# Altium schematic sheet US_EPS_LM.SchDoc
size A2
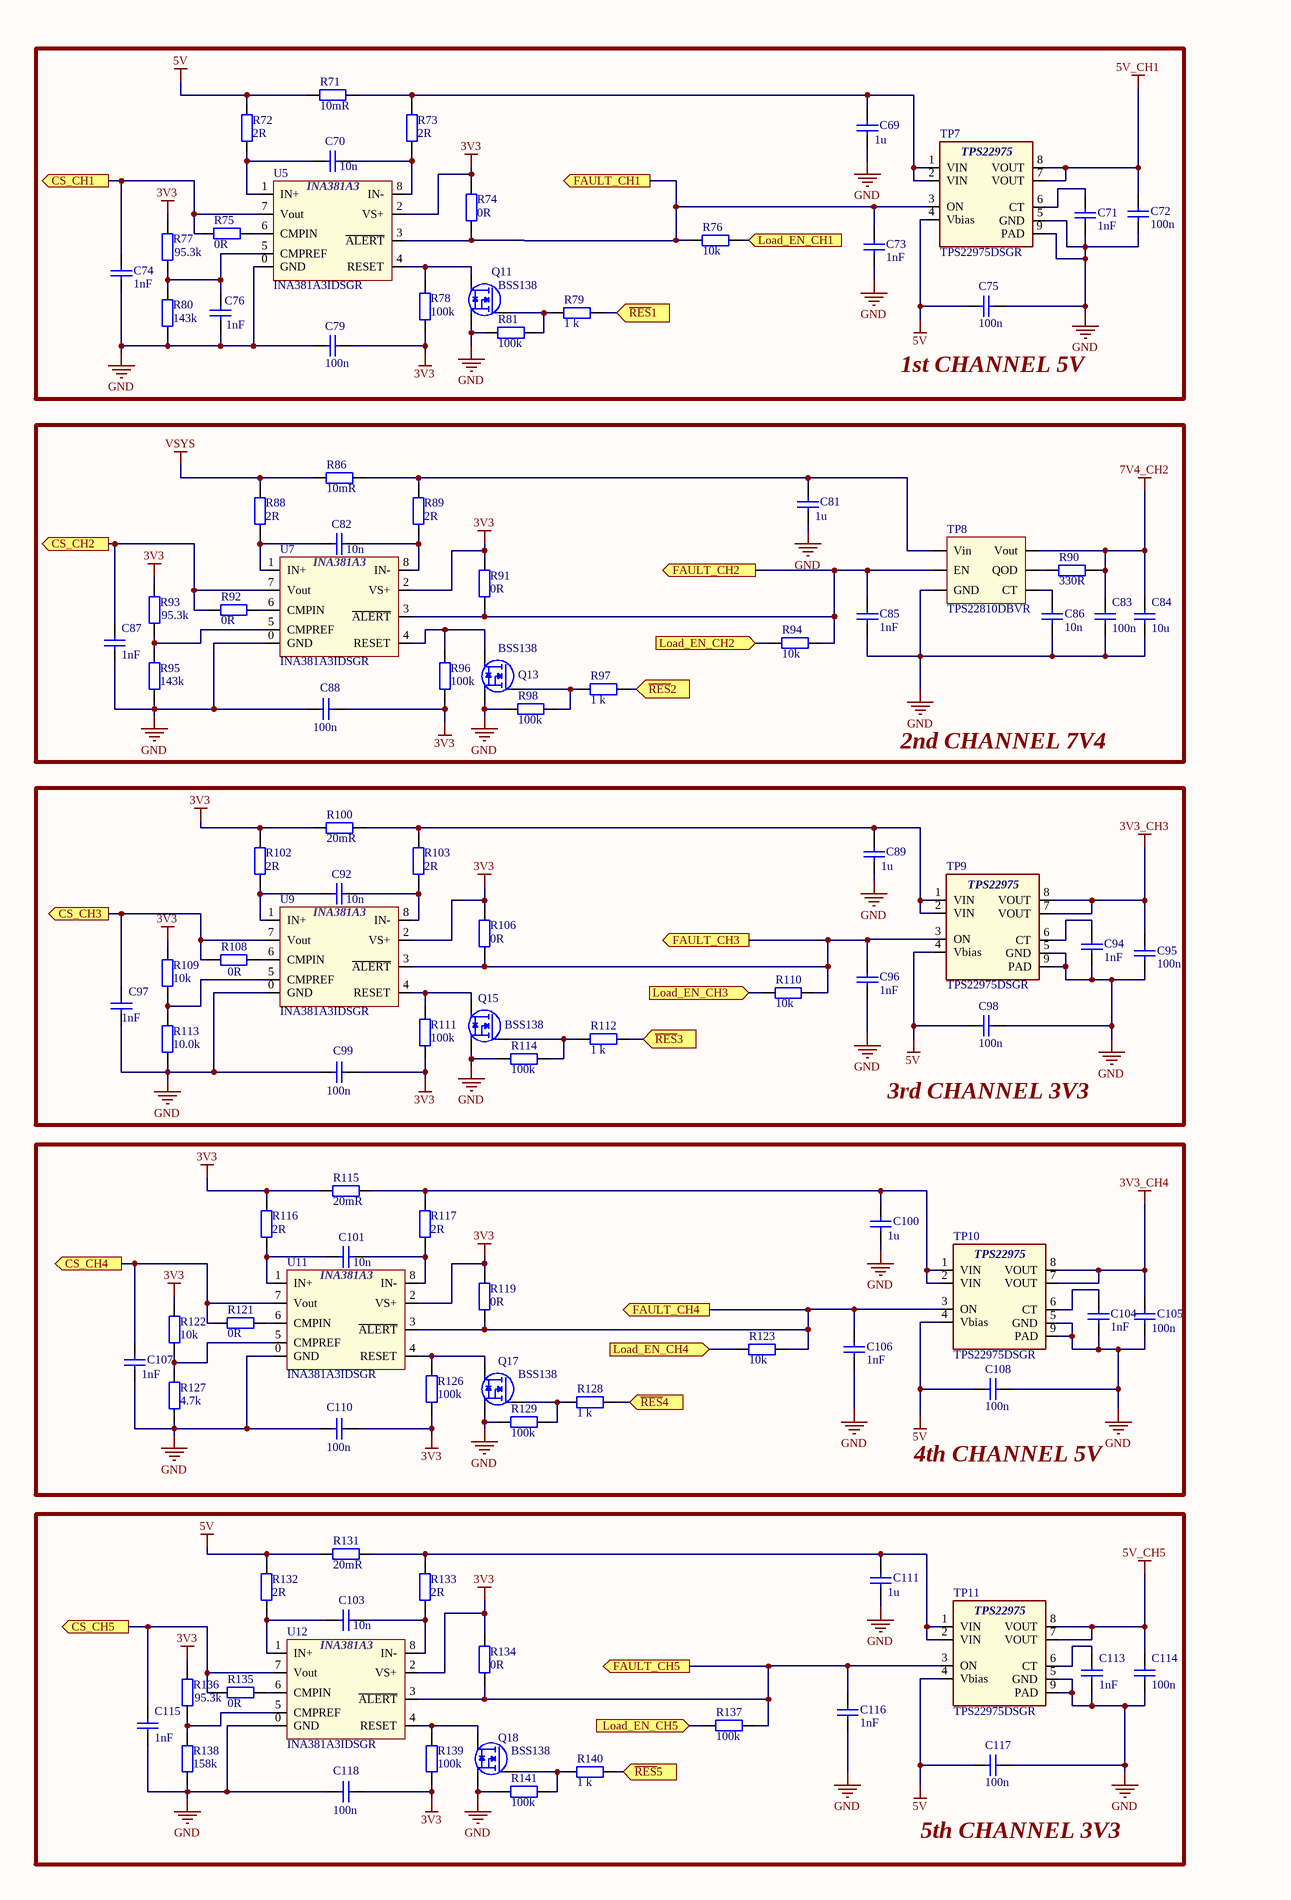
[diagram p0: US_EPS_LM.SchDoc, left]
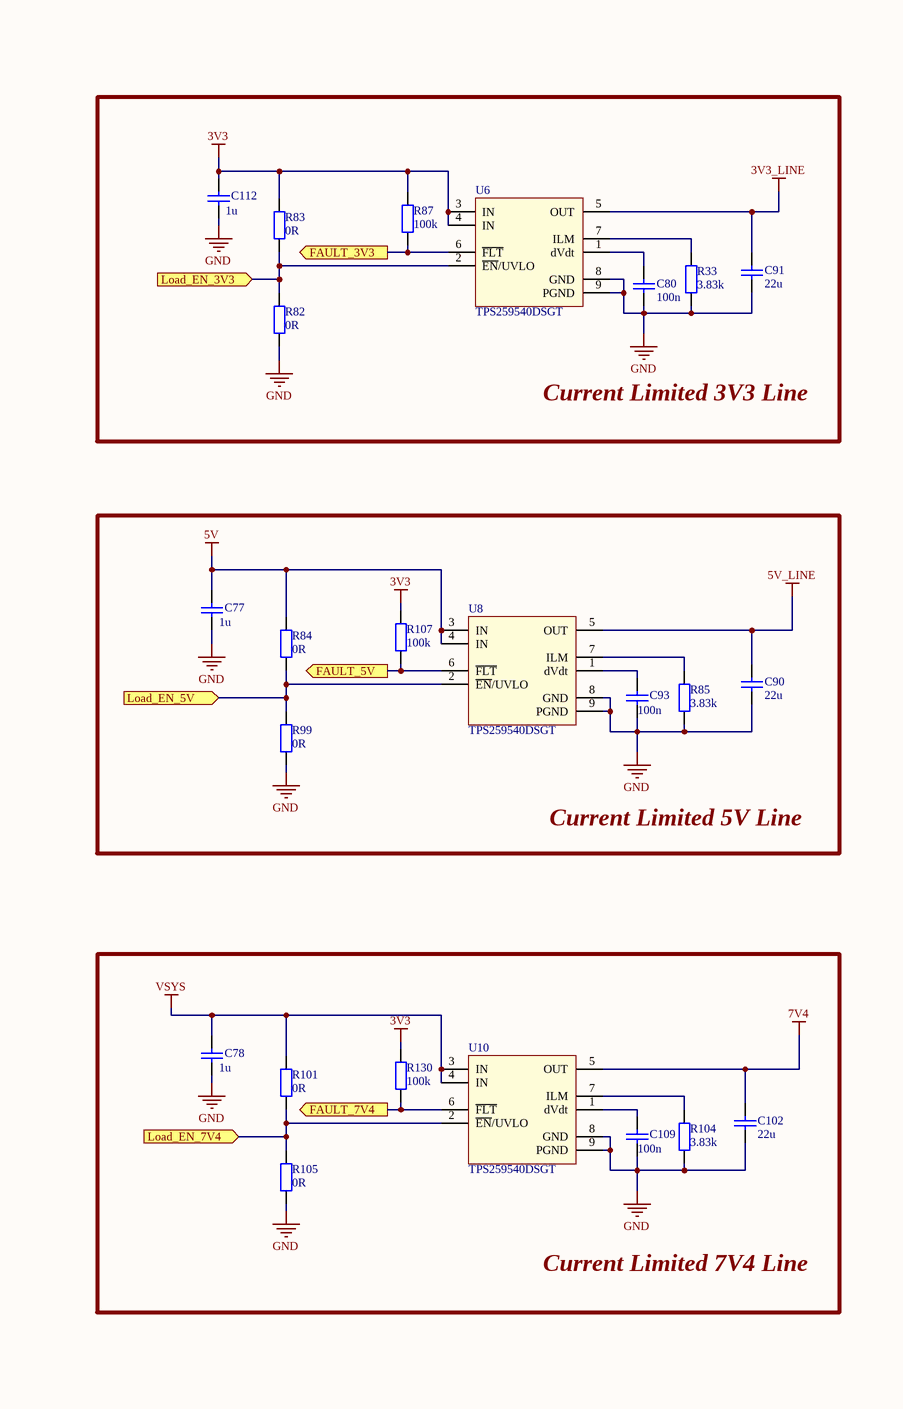
[diagram p1: US_EPS_LM.SchDoc, right]

## Parts
C69  1u  [C0603_IPC_HD]
C70  10n  [C0603_IPC_HD]
C71  1nF  [C0603_IPC_HD]
C72  100n  [C0603_IPC_HD]
C73  1nF  [C0603_IPC_HD]
C74  1nF  [C0603_IPC_HD]
C75  100n  [C0603_IPC_HD]
C76  1nF  [C0603_IPC_HD]
C77  1u  [C0603_IPC_HD]
C78  1u  [C0603_IPC_HD]
C79  100n  [C0603_IPC_HD]
C80  100n  [C0603_IPC_HD]
C81  1u  [C0603_IPC_HD]
C82  10n  [C0603_IPC_HD]
C83  100n  [C0603_IPC_HD]
C84  10u  [C0805_IPC_HD]
C85  1nF  [C0603_IPC_HD]
C86  10n  [C0603_IPC_HD]
C87  1nF  [C0603_IPC_HD]
C88  100n  [C0603_IPC_HD]
C89  1u  [C0603_IPC_HD]
C90  22u  [C0805_IPC_HD]
C91  22u  [C0805_IPC_HD]
C92  10n  [C0603_IPC_HD]
C93  100n  [C0603_IPC_HD]
C94  1nF  [C0603_IPC_HD]
C95  100n  [C0603_IPC_HD]
C96  1nF  [C0603_IPC_HD]
C97  1nF  [C0603_IPC_HD]
C98  100n  [C0603_IPC_HD]
C99  100n  [C0603_IPC_HD]
C100  1u  [C0603_IPC_HD]
C101  10n  [C0603_IPC_HD]
C102  22u  [C0805_IPC_HD]
C103  10n  [C0603_IPC_HD]
C104  1nF  [C0603_IPC_HD]
C105  100n  [C0603_IPC_HD]
C106  1nF  [C0603_IPC_HD]
C107  1nF  [C0603_IPC_HD]
C108  100n  [C0603_IPC_HD]
C109  100n  [C0603_IPC_HD]
C110  100n  [C0603_IPC_HD]
C111  1u  [C0603_IPC_HD]
C112  1u  [C0603_IPC_HD]
C113  1nF  [C0603_IPC_HD]
C114  100n  [C0603_IPC_HD]
C115  1nF  [C0603_IPC_HD]
C116  1nF  [C0603_IPC_HD]
C117  100n  [C0603_IPC_HD]
C118  100n  [C0603_IPC_HD]
Q11  BSS138  [SOT23]
Q13  BSS138  [SOT23]
Q15  BSS138  [SOT23]
Q17  BSS138  [SOT23]
Q18  BSS138  [SOT23]
R33  3.83k  [C0603_IPC_HD]
R71  10mR  [WSLP1206R001]
R72  2R  [C0603_IPC_HD]
R73  2R  [C0603_IPC_HD]
R74  0R  [R0603_IPC_MD]
R75  0R  [R0603_IPC_MD]
R76  10k  [C0603_IPC_HD]
R77  95.3k  [C0603_IPC_HD]
R78  100k  [R0603_IPC_MD]
R79  1 k  [R0603_IPC_HD]
R80  143k  [C0603_IPC_HD]
R81  100k  [R0603_IPC_MD]
R82  0R  [R0603_IPC_MD]  (no BOM)
R83  0R  [R0603_IPC_MD]  (no BOM)
R84  0R  [R0603_IPC_MD]  (no BOM)
R85  3.83k  [C0603_IPC_HD]
R86  10mR  [WSLP1206R001]
R87  100k  [R0603_IPC_MD]
R88  2R  [C0603_IPC_HD]
R89  2R  [C0603_IPC_HD]
R90  330R  [R0603_IPC_MD]
R91  0R  [R0603_IPC_MD]
R92  0R  [R0603_IPC_MD]
R93  95.3k  [C0603_IPC_HD]
R94  10k  [C0603_IPC_HD]
R95  143k  [C0603_IPC_HD]
R96  100k  [R0603_IPC_MD]
R97  1 k  [R0603_IPC_HD]
R98  100k  [R0603_IPC_MD]
R99  0R  [R0603_IPC_MD]  (no BOM)
R100  20mR  [WSLP1206R002]
R101  0R  [R0603_IPC_MD]  (no BOM)
R102  2R  [C0603_IPC_HD]
R103  2R  [C0603_IPC_HD]
R104  3.83k  [C0603_IPC_HD]
R105  0R  [R0603_IPC_MD]  (no BOM)
R106  0R  [R0603_IPC_MD]
R107  100k  [R0603_IPC_MD]
R108  0R  [R0603_IPC_MD]
R109  10k  [C0603_IPC_HD]
R110  10k  [C0603_IPC_HD]
R111  100k  [R0603_IPC_MD]
R112  1 k  [R0603_IPC_HD]
R113  10.0k  [R0603_IPC_MD]
R114  100k  [R0603_IPC_MD]
R115  20mR  [WSLP1206R002]
R116  2R  [C0603_IPC_HD]
R117  2R  [C0603_IPC_HD]
R119  0R  [R0603_IPC_MD]
R121  0R  [R0603_IPC_MD]
R122  10k  [C0603_IPC_HD]
R123  10k  [C0603_IPC_HD]
R126  100k  [R0603_IPC_MD]
R127  4.7k  [C0603_IPC_HD]
R128  1 k  [R0603_IPC_HD]
R129  100k  [R0603_IPC_MD]
R130  100k  [R0603_IPC_MD]
R131  20mR  [WSLP1206R002]
R132  2R  [C0603_IPC_HD]
R133  2R  [C0603_IPC_HD]
R134  0R  [R0603_IPC_MD]
R135  0R  [R0603_IPC_MD]
R136  95.3k  [C0603_IPC_HD]
R137  100k  [R0603_IPC_MD]
R138  158k  [R0603_IPC_HD]
R139  100k  [R0603_IPC_MD]
R140  1 k  [R0603_IPC_HD]
R141  100k  [R0603_IPC_MD]
TP7  TPS22975DSGR  [SON127P600-TPS22975]
TP8  TPS22810DBVR  [TPS22810DBVR_SOT95P280X145-6N]
TP9  TPS22975DSGR  [SON127P600-TPS22975]
TP10  TPS22975DSGR  [SON127P600-TPS22975]
TP11  TPS22975DSGR  [SON127P600-TPS22975]
U5  INA381A3IDSGR  [SON127P600-8N(INA381)]
U6  TPS259540DSGT  [SON127P600-8N_TPS259540DSGT]
U7  INA381A3IDSGR  [SON127P600-8N(INA381)]
U8  TPS259540DSGT  [SON127P600-8N_TPS259540DSGT]
U9  INA381A3IDSGR  [SON127P600-8N(INA381)]
U10  TPS259540DSGT  [SON127P600-8N_TPS259540DSGT]
U11  INA381A3IDSGR  [SON127P600-8N(INA381)]
U12  INA381A3IDSGR  [SON127P600-8N(INA381)]

## Blocks framed on the sheet
1st CHANNEL 5V: C69-C76 C79 Q11 R71-R81 TP7 U5
Current Limited 3V3 Line: C80 C91 C112 R33 R82 R83 R87 U6
2nd CHANNEL 7V4: C81-C88 Q13 R86 R88-R98 TP8 U7
Current Limited 5V Line: C77 C90 C93 R84 R85 R99 R107 U8
3rd CHANNEL 3V3: C89 C92 C94-C99 Q15 R100 R102 R103 R106 R108-R114 TP9 U9
Current Limited 7V4 Line: C78 C102 C109 R101 R104 R105 R130 U10
4th CHANNEL 5V: C100 C101 C104-C108 C110 Q17 R115-R117 R119 R121-R123 R126-R129 TP10 U11
5th CHANNEL 3V3: C103 C111 C113-C118 Q18 R131-R141 TP11 U12

## Ports
CS_CH1 (out), CS_CH2 (out), CS_CH3 (out), CS_CH4 (out), CS_CH5 (out), FAULT_3V3 (out), FAULT_5V (out), FAULT_7V4 (out), FAULT_CH1 (out), FAULT_CH2 (out), FAULT_CH3 (out), FAULT_CH4 (out), FAULT_CH5 (out), Load_EN_3V3 (in), Load_EN_5V (in), Load_EN_7V4 (in), Load_EN_CH1 (in), Load_EN_CH2 (in), Load_EN_CH3 (in), Load_EN_CH4 (in), Load_EN_CH5 (in), ~{RES}1 (in), ~{RES}2 (in), ~{RES}3 (in), ~{RES}4 (in), ~{RES}5 (in)

## Nets
3V3: C79.1 C88.2 C99.2 C110.2 C112.2 C118.2 R74.1 R77.2 R78.1 R83.2 R87.2 R91.1 R93.2 R96.2 R100.1 R102.2 R106.1 R107.2 R109.1 R111.2 R115.1 R116.2 R119.1 R122.1 R126.2 R130.2 R134.1 R136.2 R139.2 U5.2(VS+) U6.3(IN) U6.4(IN) U7.2(VS+) U9.2(VS+) U11.2(VS+) U12.2(VS+)
3V3_CH3: C95.2 TP9.7(VOUT) TP9.8(VOUT)
3V3_CH4: C105.2 TP10.7(VOUT) TP10.8(VOUT)
3V3_LINE: C91.2 U6.5(OUT)
5V: C75.2 C77.2 C98.2 C108.2 C117.2 R71.1 R72.2 R84.2 R131.1 R132.2 TP7.4(Vbias) TP9.4(Vbias) TP10.4(Vbias) TP11.4(Vbias) U8.3(IN) U8.4(IN)
5V_CH1: C72.2 TP7.7(VOUT) TP7.8(VOUT)
5V_CH5: C114.2 TP11.7(VOUT) TP11.8(VOUT)
5V_LINE: C90.2 U8.5(OUT)
7V4: C102.2 U10.5(OUT)
7V4_CH2: C83.2 C84.2 R90.1 TP8.6(Vout)
GND: C69.1 C71.1 C72.1 C73.1 C74.1 C75.1 C76.1 C77.1 C78.1 C79.2 C80.2 C81.1 C83.1 C84.1 C85.1 C86.1 C87.1 C88.1 C89.1 C90.1 C91.1 C93.2 C94.1 C95.1 C96.1 C97.1 C98.1 C99.1 C100.1 C102.1 C104.1 C105.1 C106.1 C107.1 C108.1 C109.2 C110.1 C111.1 C112.1 C113.1 C114.1 C115.1 C116.1 C117.1 C118.1 Q11.2(S) Q13.2(S) Q15.2(S) Q17.2(S) Q18.2(S) R33.1 R80.1 R81.2 R82.1 R85.1 R95.1 R98.1 R99.1 R104.1 R105.1 R113.1 R114.1 R127.1 R129.1 R138.1 R141.1 TP7.5(GND) TP7.9(PAD) TP8.2(GND) TP9.5(GND) TP9.9(PAD) TP10.5(GND) TP10.9(PAD) TP11.5(GND) TP11.9(PAD) U5.0(GND) U6.8(GND) U6.9(PGND) U7.0(GND) U8.8(GND) U8.9(PGND) U9.0(GND) U10.8(GND) U10.9(PGND) U11.0(GND) U12.0(GND)
VSYS: C78.2 R86.1 R88.2 R101.2 U10.3(IN) U10.4(IN)
~{RES}1: R79.2 ; port ~{RES}1
~{RES}2: R97.2 ; port ~{RES}2
~{RES}3: R112.2 ; port ~{RES}3
~{RES}4: R128.2 ; port ~{RES}4
~{RES}5: R140.2 ; port ~{RES}5
CS_CH1: C74.2 R75.1 U5.7(Vout) ; port CS_CH1
CS_CH2: C87.2 R92.1 U7.7(Vout) ; port CS_CH2
CS_CH3: C97.2 R108.2 U9.7(Vout) ; port CS_CH3
CS_CH4: C107.2 R121.2 U11.7(Vout) ; port CS_CH4
CS_CH5: C115.2 R135.2 U12.7(Vout) ; port CS_CH5
FAULT_3V3: R87.1 U6.6(~{FLT}) ; port FAULT_3V3
FAULT_5V: R107.1 U8.6(~{FLT}) ; port FAULT_5V
FAULT_7V4: R130.1 U10.6(~{FLT}) ; port FAULT_7V4
FAULT_CH1: C73.2 R74.2 R76.2 TP7.3(ON) U5.3(~{ALERT}) ; port FAULT_CH1
FAULT_CH2: C85.2 R91.2 R94.1 TP8.3(EN) U7.3(~{ALERT}) ; port FAULT_CH2
FAULT_CH3: C96.2 R106.2 R110.1 TP9.3(ON) U9.3(~{ALERT}) ; port FAULT_CH3
FAULT_CH4: C106.2 R119.2 R123.1 TP10.3(ON) U11.3(~{ALERT}) ; port FAULT_CH4
FAULT_CH5: C116.2 R134.2 R137.1 TP11.3(ON) U12.3(~{ALERT}) ; port FAULT_CH5
Load_EN_3V3: R82.2 R83.1 U6.2(~{EN}/UVLO) ; port Load_EN_3V3
Load_EN_5V: R84.1 R99.2 U8.2(~{EN}/UVLO) ; port Load_EN_5V
Load_EN_7V4: R101.1 R105.2 U10.2(~{EN}/UVLO) ; port Load_EN_7V4
Load_EN_CH1: R76.1 ; port Load_EN_CH1
Load_EN_CH2: R94.2 ; port Load_EN_CH2
Load_EN_CH3: R110.2 ; port Load_EN_CH3
Load_EN_CH4: R123.2 ; port Load_EN_CH4
Load_EN_CH5: R137.2 ; port Load_EN_CH5
NetC69_2: C69.2 R71.2 R73.2 TP7.1(VIN) TP7.2(VIN)
NetC70_1: C70.1 R72.1 U5.1(IN+)
NetC70_2: C70.2 R73.1 U5.8(IN-)
NetC71_2: C71.2 TP7.6(CT)
NetC76_2: C76.2 R77.1 R80.2 U5.5(CMPREF)
NetC80_1: C80.1 U6.1(dVdt)
NetC81_2: C81.2 R86.2 R89.2 TP8.1(Vin)
NetC82_1: C82.1 R88.1 U7.1(IN+)
NetC82_2: C82.2 R89.1 U7.8(IN-)
NetC86_2: C86.2 TP8.4(CT)
NetC89_2: C89.2 R100.2 R103.2 TP9.1(VIN) TP9.2(VIN)
NetC92_1: C92.1 R102.1 U9.1(IN+)
NetC92_2: C92.2 R103.1 U9.8(IN-)
NetC93_1: C93.1 U8.1(dVdt)
NetC94_2: C94.2 TP9.6(CT)
NetC100_2: C100.2 R115.2 R117.2 TP10.1(VIN) TP10.2(VIN)
NetC101_1: C101.1 R116.1 U11.1(IN+)
NetC101_2: C101.2 R117.1 U11.8(IN-)
NetC103_1: C103.1 R132.1 U12.1(IN+)
NetC103_2: C103.2 R133.1 U12.8(IN-)
NetC104_2: C104.2 TP10.6(CT)
NetC109_1: C109.1 U10.1(dVdt)
NetC111_2: C111.2 R131.2 R133.2 TP11.1(VIN) TP11.2(VIN)
NetC113_2: C113.2 TP11.6(CT)
NetQ11_1: Q11.1(G) R79.1 R81.1
NetQ11_3: Q11.3(D) R78.2 U5.4(RESET)
NetQ13_1: Q13.1(G) R97.1 R98.2
NetQ13_3: Q13.3(D) R96.1 U7.4(RESET)
NetQ15_1: Q15.1(G) R112.1 R114.2
NetQ15_3: Q15.3(D) R111.1 U9.4(RESET)
NetQ17_1: Q17.1(G) R128.1 R129.2
NetQ17_3: Q17.3(D) R126.1 U11.4(RESET)
NetQ18_1: Q18.1(G) R140.1 R141.2
NetQ18_3: Q18.3(D) R139.1 U12.4(RESET)
NetR33_2: R33.2 U6.7(ILM)
NetR75_2: R75.2 U5.6(CMPIN)
NetR85_2: R85.2 U8.7(ILM)
NetR90_2: R90.2 TP8.5(QOD)
NetR92_2: R92.2 U7.6(CMPIN)
NetR93_1: R93.1 R95.2 U7.5(CMPREF)
NetR104_2: R104.2 U10.7(ILM)
NetR108_1: R108.1 U9.6(CMPIN)
NetR109_2: R109.2 R113.2 U9.5(CMPREF)
NetR121_1: R121.1 U11.6(CMPIN)
NetR122_2: R122.2 R127.2 U11.5(CMPREF)
NetR135_1: R135.1 U12.6(CMPIN)
NetR136_1: R136.1 R138.2 U12.5(CMPREF)

## Notes on the sheet
- (in symbol INA381A3IDSGR) INA381A3

## Library data of the parts
C69 C77 C78 C81 C89 C100 C111 C112 = CL10B105MO8NNWC: CAP CER 1UF 16V X7R 0603; Manufacturer: Samsung Electro-Mechanics; Manufacturer Part Number: CL10B105MO8NNWC; Voltage: 16V; Value: 1u; Dielectric: X7R; Supplier 1: Digi-Key; Supplier Part Number 1: 1276-6524-1-ND
C70 C82 C86 C92 C101 C103 = CL10B103KB8NNNC: CAP CER 0.01UF 50V X7R 0603; Manufacturer: Samsung Electro-Mechanics; Manufacturer Part Number: CL10B103KB8NNNC; Voltage: 50V; Value: 10n; Dielectric: X7R; Supplier 1: Digi-Key; Supplier Part Number 1: 1276-1009-1-ND
C71 C73 C74 C76 C85 C87 C94 C96 C97 C104 C106 C107 C113 C115 C116 = CL0603_1nF_0603: CAP CER 1000PF 50V X7R 0603; Manufacturer: Samsung Electro-Mechanics; Manufacturer Part Number: CL10B102KB8NNNC; Voltage: 50V; Value: 1nF; Dielectric: X7R; Supplier 1: Digi-Key; Supplier Part Number 1: 1276-1018-1-ND
C72 C75 C79 C80 C83 C88 C93 C95 C98 C99 C105 C108-C110 C114 C117 C118 = CL10B104KO8NNNC: CAP CER 0.1UF 16V X7R 0603; Manufacturer: Samsung Electro-Mechanics; Manufacturer Part Number: CL10B104KO8NNNC; Voltage: 16V; Value: 100n; Dielectric: X7R; Supplier 1: Digi-Key; Supplier Part Number 1: 1276-1005-1-ND
C84 = CL21B106KOQNNNG: CAP CER 10UF 16V X7R 0805; Manufacturer: Samsung Electro-Mechanics; Manufacturer Part Number: CL21B106KOQNNNG; Voltage: 16V; Value: 10u; Dielectric: X7R; Supplier 1: Digi-Key; Supplier Part Number 1: 1276-6472-1-ND
C90 C91 C102 = CL21A226MOCLRNC: CAP CER 22UF 16V X5R 0805; Manufacturer: Samsung Electro-Mechanics; Manufacturer Part Number: CL21A226MOCLRNC; Voltage: 16V; Value: 22u; Dielectric: X5R; Supplier 1: Digi-Key; Supplier Part Number 1: 1276-6780-1-ND
Q11 Q13 Q15 Q17 Q18 = BSS138: N-Channel Logic Level Enhancement Mode Field Effect Transistor; Manufacturer: Diodes Incorporated; Manufacturer Part Number: BSS138; Supplier 1: Digi-Key; Supplier Part Number 1: BSS138-FDICT-ND
R33 R85 R104 = CR0603-JW-3.83k: RES SMD 3.83K OHM 1% 1/10W 0603; Manufacturer: Yageo; Manufacturer Part Number: RC0603FR-073K83L; Value: 3.83k; Tolarance: ±1%; Supplier 1: Digi-Key; Supplier Part Number 1: 311-3.83KHRCT-ND
R71 R86 = WSLP1206R001: 10 mOhms ±1% 1W Chip Resistor 1206 (3216 Metric) Anti-Sulfur, Automotive AEC-Q200, Current Sense, Moisture Resistant, Pulse Withstanding Metal Element; Manufacturer: Vishay Dale; Manufacturer Part Number: WSLP1206R0100FEA; Value: 10mR; Tolarance: 1%; Supplier 1: Digi-Key; Supplier Part Number 1: WSLP-.01CT-ND
R72 R73 R88 R89 R102 R103 R116 R117 R132 R133 = CR0603-JW-2R: 2 Ohms ±1% 0.125W, 1/8W Chip Resistor 0603 (1608 Metric) Automotive AEC-Q200 Thick Film; Manufacturer: KOA Speer Electronics, Inc.; Manufacturer Part Number: RK73H1JTTD2R00F; Value: 2R; Tolarance: ±1%; Supplier 1: Digi-Key; Supplier Part Number 1: 2019-RK73H1JTTD2R00FCT-ND
R74 R75 R82-R84 R91 R92 R99 R101 R105 R106 R108 R119 R121 R134 R135 = CR0603-J/-000ELF: RES SMD 0 OHM JUMPER 1/10W 0603; Manufacturer: Bourns Inc.; Tolarance: 1%; Value: 0R; Manufacturer Part Number: CR0603-J/-000ELF; Supplier 1: Digi-Key; Supplier Part Number 1: CR0603-J/-000ELFCT-ND
R76 R94 R109 R110 R122 R123 = CR0603-JW-10k: RES 10K OHM 1% 1/10W 0603; Manufacturer: Stackpole Electronics Inc; Manufacturer Part Number: RMCF0603FT10K0; Value: 10k; Tolarance: ±1%; Supplier 1: Digi-Key; Supplier Part Number 1: RMCF0603FT10K0CT-ND
R77 R93 R136 = CR0603-JW-95.3k: RES 95.3K OHM 1% 1/10W 0603; Manufacturer: Stackpole Electronics Inc; Manufacturer Part Number: RMCF0603FT95K3; Value: 95.3k; Tolarance: ±1%; Supplier 1: Digi-Key; Supplier Part Number 1: RMCF0603FT95K3CT-ND
R78 R81 R87 R96 R98 R107 R111 R114 R126 R129 R130 R137 R139 R141 = CR0603-JW-104ELF: RES 100K OHM 1% 1/10W 0603; Manufacturer: Stackpole Electronics Inc; Manufacturer Part Number: RMCF0603FT100K; Value: 100k; Tolarance: ±1%; Supplier 1: Digi-Key; Supplier Part Number 1: RMCF0603FT100KCT-ND
R79 R97 R112 R128 R140 = CR0603-JW-1k_ISL92: 1 kOhms ±1% 0.1W, 1/10W Chip Resistor 0603 (1608 Metric) Automotive AEC-Q200 Thick Film; Manufacturer: Stackpole Electronics Inc; Manufacturer Part Number: RMCF0603FT1K00; Value: 1 k; Tolarance: ±1%; Supplier 1: Digi-Key; Supplier Part Number 1: RMCF0603FT1K00CT-ND
R80 R95 = CR0603-JW-147kR: RES 143K OHM 1% 1/10W 0603; Manufacturer: Stackpole Electronics Inc; Manufacturer Part Number: RMCF0603FT143K; Value: 143k; Tolarance: ±1%; Supplier 1: Digi-Key; Supplier Part Number 1: RMCF0603FT143KCT-ND
R90 = CR0603-JW-331ELF: RES SMD 330 OHM 5% 1/10W 0603; Manufacturer: Bourns Inc.; Value: 330R; Tolarance: 5%; Manufacturer Part Number: CR0603-JW-331ELF; Supplier 1: Digi-Key; Supplier Part Number 1: CR0603-JW-331ELFCT-ND
R100 R115 R131 = WSLP1206R002: 20 mOhms ±1% 1W Chip Resistor 1206 (3216 Metric) Anti-Sulfur, Automotive AEC-Q200, Current Sense, Moisture Resistant, Pulse Withstanding Metal Element; Manufacturer: Vishay Dale; Manufacturer Part Number: WSLP1206R0200FEA; Value: 20mR; Tolarance: 1%; Supplier 1: Digi-Key; Supplier Part Number 1: WSLP-.02CT-ND
R113 = RMCF0603FT10K0: RES 10K OHM 1% 1/10W 0603; Manufacturer: Stackpole Electronics Inc; Value: 10.0k; Tolarance: 1%; Manufacturer Part Number: RMCF0603FT10K0; Supplier 1: Digi-Key; Supplier Part Number 1: RMCF0603FT10K0CT-ND
R127 = CR0603-JW-4.7kOm: RES SMD 4.7K OHM 5% 1/10W 0603; Manufacturer: Bourns Inc.; Manufacturer Part Number: CR0603-JW-472ELF; Value: 4.7k; Tolarance: ±5%; Supplier 1: Digi-Key; Supplier Part Number 1: CR0603-JW-472ELFCT-ND
R138 = CR0603-JW-158k: 58K ±1% 1/10W ±100ppm/℃ 0603; Manufacturer: PANASONIC; Manufacturer Part Number: ERJ3EKF1583V; Value: 158k; Tolarance: 1%; Supplier 1: LCSC; Supplier Part Number 1: C403004
TP7 TP9-TP11 = TPS22975: IC LOAD SWITCH N-CH 6A; Manufacturer: Texas Instruments; Manufacturer Part Number: TPS22975DSGR; Supplier 1: Digi-Key; Supplier Part Number 1: 296-47228-1-ND
TP8 = TPS22810DBVR: Power Switch/Driver 1:1 N-Channel 2A SOT-23-6; Manufacturer: Texas Instruments; Manufacturer Part Number: TPS22810DBVR; Supplier 1: Digi-Key; Supplier Part Number 1: 296-45297-1-ND
U5 U7 U9 U11 U12 = INA381A3IDSGR: Current Sense Regulator High/Low-Side  8-WSON (2x2); Manufacturer: Texas Instruments; Manufacturer Part Number: INA381A3IDSGR; Supplier 1: Digi-Key; Supplier Part Number 1: 296-50476-1-ND
U6 U8 U10 = TPS259540DSGT: IC PWR MGMT EFUSE 2.7-18V 8WSON; Manufacturer: Texas Instruments; Manufacturer Part Number: TPS259540DSGT; Supplier 1: Digi-Key; Supplier Part Number 1: 296-47957-1-ND